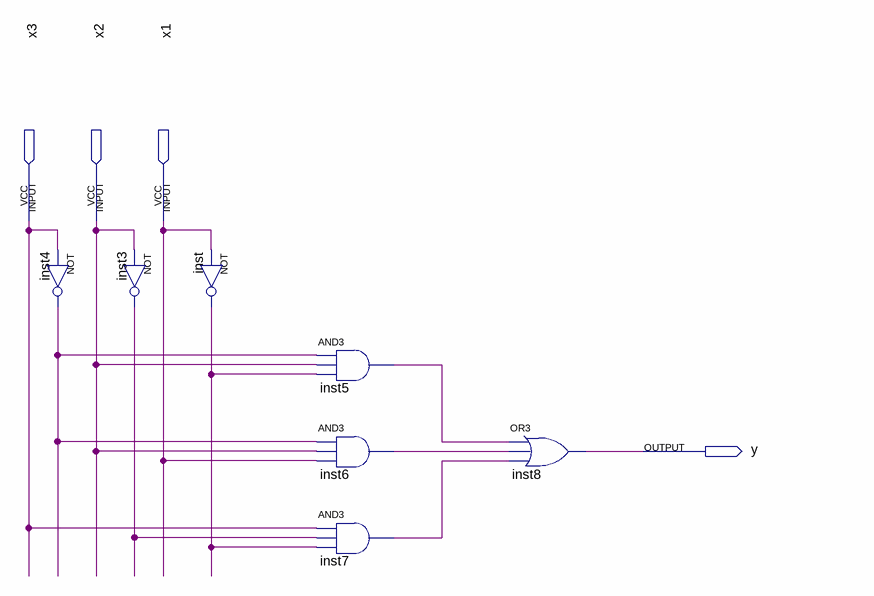
[diagram p0: schematic sheet]
// Quartus schematic L0103.bdf as structural Verilog: 7 symbols, 4 pins
module L0103 (
  input  x3,
  input  x2,
  input  x1,
  output y
);

  wire inst3_out, inst4_out, inst5_out, inst6_out, inst7_out, inst_out;

  not inst4 (inst4_out, x3);
  not inst3 (inst3_out, x2);
  not inst (inst_out, x1);
  and inst5 (inst5_out, inst4_out, x2, inst_out);
  and inst6 (inst6_out, inst4_out, x2, x1);
  and inst7 (inst7_out, x3, inst3_out, inst_out);
  or inst8 (y, inst5_out, inst6_out, inst7_out);
endmodule
